# EAGLE design ESP32-SIM7000-with-lipo-v1 (EAGLE 8.7.1)

## Sheet 1 of 2
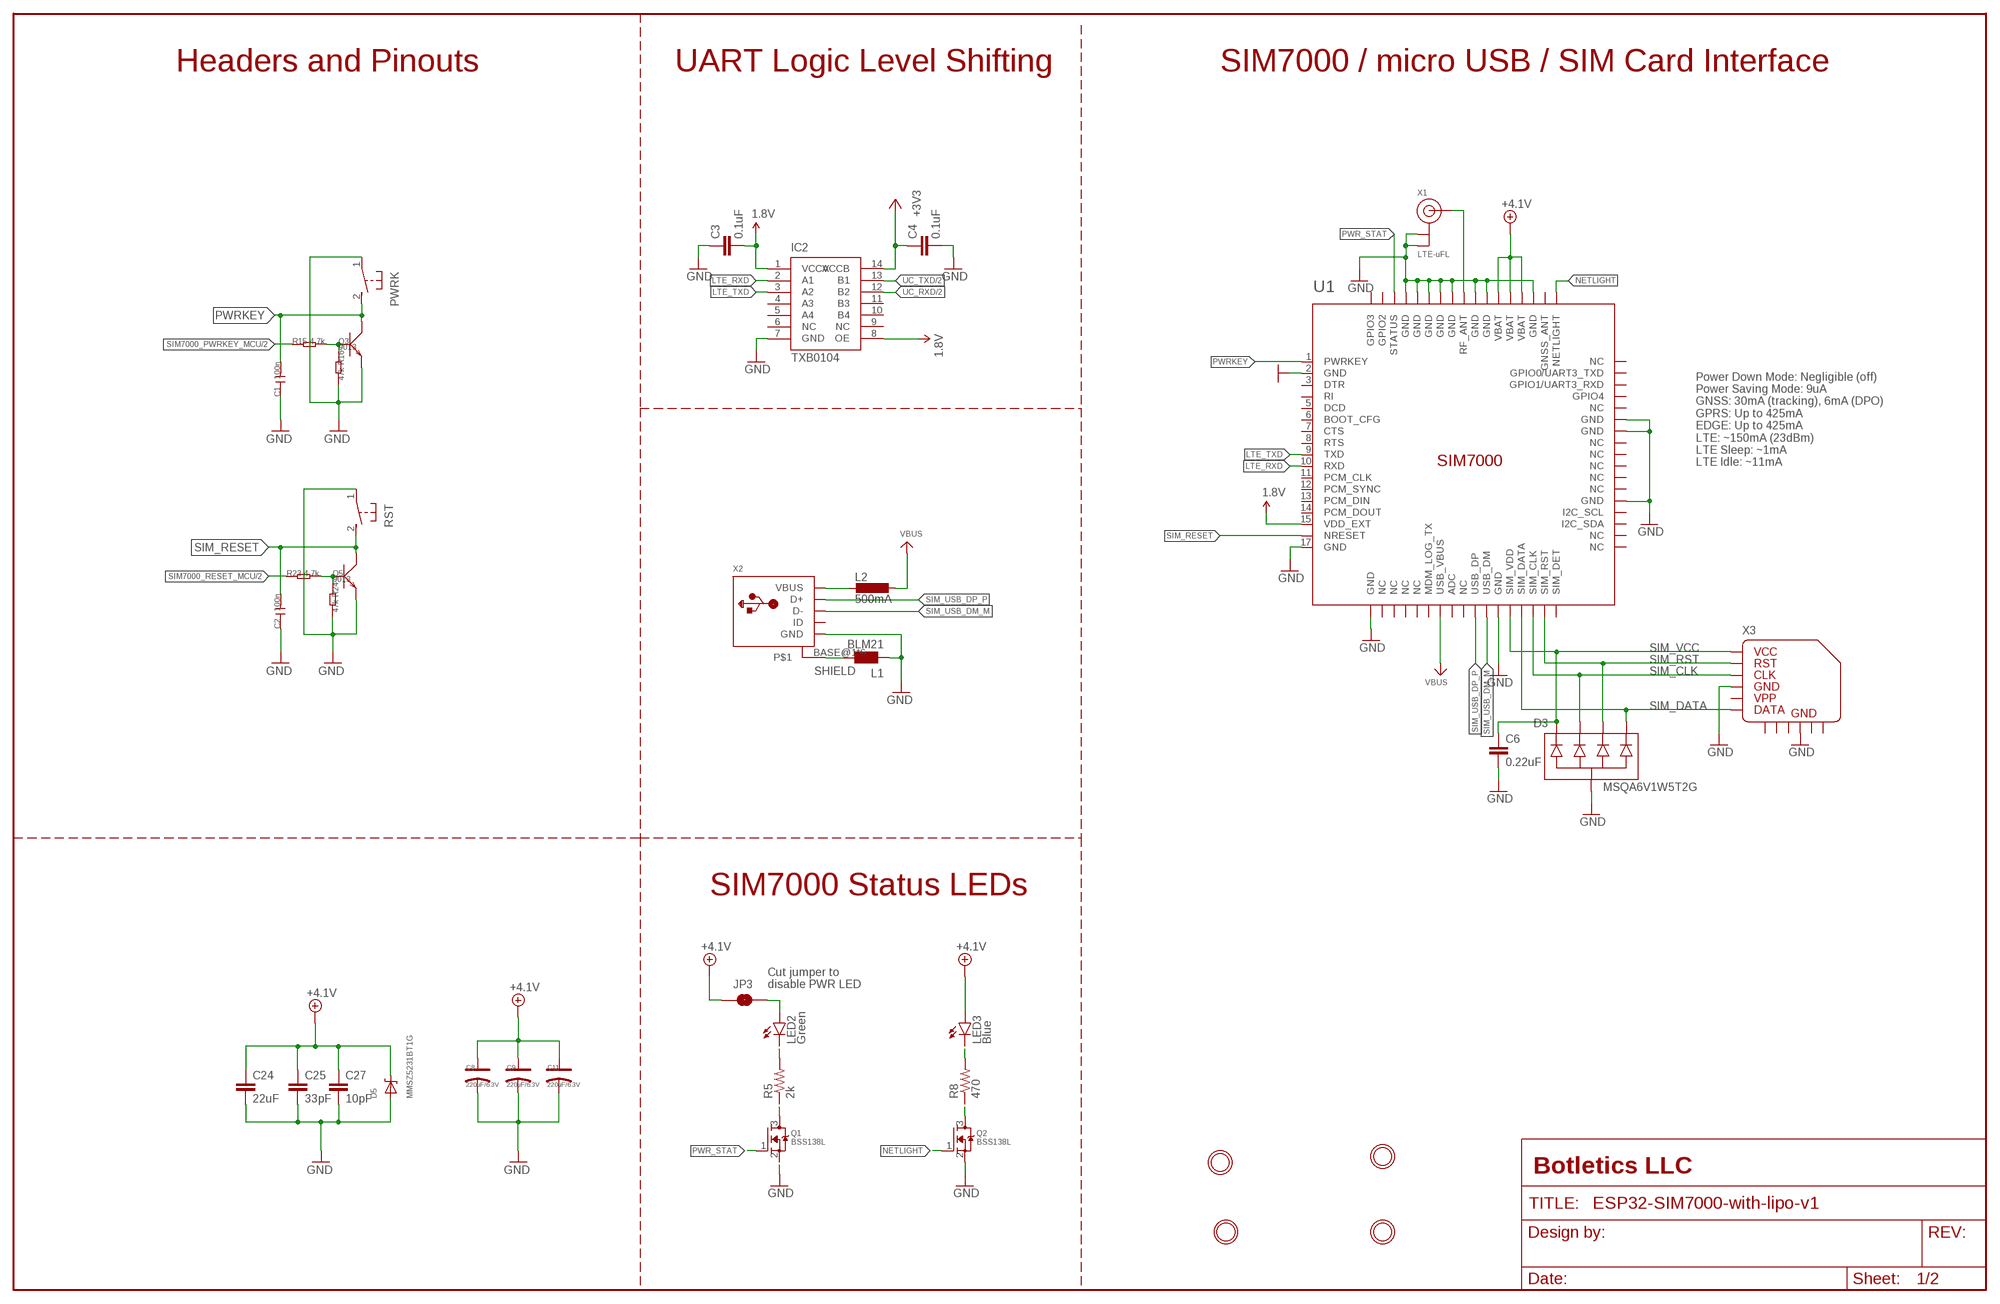
[diagram p0: schematic, sheet 1]

### Parts
$H1  MOUNTINGHOLE3.0THIN  [MOUNTINGHOLE_3.0_PLATEDTHIN]
$H2  MOUNTINGHOLE3.0THIN  [MOUNTINGHOLE_3.0_PLATEDTHIN]
$H3  MOUNTINGHOLE3.0THIN  [MOUNTINGHOLE_3.0_PLATEDTHIN]
$H4  MOUNTINGHOLE3.0THIN  [MOUNTINGHOLE_3.0_PLATEDTHIN]
C1  100n  C-0805  [0805]
C2  100n  C-0805  [0805]
C3  0.1uF  CAPMARKED-0603  [0603-CAP-MARKED]
C4  0.1uF  CAPMARKED-0603  [0603-CAP-MARKED]
C6  0.22uF  CAPMARKED-0603  [0603-CAP-MARKED]
C8  220uF/6.3V  006-CAP_AVX_C  [AVX_C]
C9  220uF/6.3V  006-CAP_AVX_C  [AVX_C]
C11  220uF/6.3V  006-CAP_AVX_C  [AVX_C]
C24  22uF  22UF-0805-6.3V-20%  [0805]
C25  33pF  22UF-0805-6.3V-20%  [0805]
C27  10pF  22UF-0805-6.3V-20%  [0805]
D3  MSQA6V1W5T2G  TVS-DIODE-ARRAY-4X  [SOT-353]
D5  MMSZ5231BT1G  DIODE-ZENERSOD123  [SOD-123]
IC2  TXB0104  LEVEL_SHIFTER_TXB0104TXB0104DR  [SOIC-14]
JP3  JUMPER-SMT_2_NC_TRACE_SILK  [SMT-JUMPER_2_NC_TRACE_SILK]
L1  BLM21  WE-CBF_0805  [0805]
L2  500mA  L-EUL1812  [L1812]
LED2  Green  LED0603-MARKED  [LED-0603-MARKED]
LED3  Blue  LED0603-MARKED  [LED-0603-MARKED]
PWRK  DTSM-3  [DTSM-3]
Q1  BSS138L  MOSFET-NGENERIC  [SOT23-3]
Q2  BSS138L  MOSFET-NGENERIC  [SOT23-3]
Q3  9013  TRANSISTOR-NPN-SOT23  [SOT23]
Q5  9013  TRANSISTOR-NPN-SOT23  [SOT23]
R5  2k  RESISTORMARKED-0603  [0603-RES-MARKED]
R8  470  RESISTORMARKED-0603  [0603-RES-MARKED]
R15  4.7k  R-0805  [0805]
R16  47k  R-0805  [0805]
R23  4.7k  R-0805  [0805]
R24  47k  R-0805  [0805]
RST  DTSM-3  [DTSM-3]
U1  SIM7000  [SIM7000]
X1  LTE-uFL  ANTENNA_U.FL  [U.FL]
X2  USB_MICRO_20329_V2  [4UCONN_20329_V2]
X3  MICROSIM_SOCKET_PUSH-PULL  [MICROSIM_SOCKET_PUSH-PULL]

### Nets
1.8V: C3.2 IC2.1(VCCA) IC2.8(OE) U1.15(VDD_EXT)
+3V3: C4.1 IC2.14(VCCB) ; also sheet 2
+4.1V: C8.+ C9.+ C11.+ C24.1 C25.1 C27.1 D5.C JP3.1 LED3.A U1.55(VBAT) U1.56(VBAT) U1.57(VBAT) ; also sheet 2
GND: C1.1 C2.1 C3.1 C4.2 C6.2 C8.- C9.- C11.- C24.2 C25.2 C27.2 D3.2(COM) D5.A IC2.7(GND) L1.1 PWRK.1 Q1.2(S) Q2.2(S) Q3.2(E) Q5.2(E) R16.2 R24.2 RST.1 U1.2(GND) U1.17(GND) U1.18(GND) U1.29(GND) U1.39(GND) U1.45(GND) U1.46(GND) U1.54(GND) U1.58(GND) U1.59(GND) U1.61(GND) U1.62(GND) U1.63(GND) U1.64(GND) U1.65(GND) X1.1(GND) X1.2(GND) X2.GND X3.C5 X3.GND@4(GND) ; also sheet 2
LTE_RXD: IC2.2(A1) U1.10(RXD)
LTE_TXD: IC2.3(A2) U1.9(TXD)
N$4: Q1.3(D) R5.1
N$5: LED2.C R5.2
N$10: Q2.3(D) R8.1
N$11: LED3.C R8.2
N$12: JP3.2 LED2.A
N$14: Q5.1(B) R23.2 R24.1
N$15: L2.2 X2.VBUS
N$36: Q3.1(B) R15.2 R16.1
NETLIGHT: Q2.1(G) U1.52(NETLIGHT)
PWR_STAT: Q1.1(G) U1.66(STATUS)
PWRKEY: C1.2 PWRK.2 Q3.3(C) U1.1(PWRKEY)
RF_ANT: U1.60(RF_ANT) X1.3(SIGNAL)
SHIELD: L1.2 X2.BASE@1 X2.BASE@2 X2.SPRT@1 X2.SPRT@2 X2.SPRT@3 X2.SPRT@4
SIM7000_PWRKEY_MCU: R15.1 ; also sheet 2
SIM7000_RESET_MCU: R23.1 ; also sheet 2
SIM_CLK: D3.3 U1.32(SIM_CLK) X3.C3
SIM_DATA: D3.5 U1.31(SIM_DATA) X3.C7
SIM_RESET: C2.2 Q5.3(C) RST.2 U1.16(NRESET)
SIM_RST: D3.4 U1.33(SIM_RST) X3.C2
SIM_USB_DM_M: U1.28(USB_DM) X2.D-
SIM_USB_DP_P: U1.27(USB_DP) X2.D+
SIM_VCC: C6.1 D3.1 U1.30(SIM_VDD) X3.C1
UC_RXD: IC2.12(B2) ; also sheet 2
UC_TXD: IC2.13(B1) ; also sheet 2
VBUS [usbvcc]: L2.1 U1.24(USB_VBUS) ; also sheet 2
Unconnected: IC2.4(A3) IC2.5(A4) IC2.6(NC) IC2.9(NC) IC2.10(B4) IC2.11(B3) U1.3(DTR) U1.4(RI) U1.5(DCD) U1.6(BOOT_CFG) U1.7(CTS) U1.8(RTS) U1.11(PCM_CLK) U1.12(PCM_SYNC) U1.13(PCM_DIN) U1.14(PCM_DOUT) U1.19(NC) U1.20(NC) U1.21(NC) U1.22(NC) U1.23(MDM_LOG_TX) U1.25(ADC) U1.26(NC) U1.34(SIM_DET) U1.35(NC) U1.36(NC) U1.37(I2C_SDA) U1.38(I2C_SCL) U1.40(NC) U1.41(NC) U1.42(NC) U1.43(NC) U1.44(NC) U1.47(NC) U1.48(GPIO4) U1.49(GPIO1/UART3_RXD) U1.50(GPIO0/UART3_TXD) U1.51(NC) U1.53(GNSS_ANT) U1.67(GPIO2) U1.68(GPIO3) X2.ID X3.C6

### Notes on the sheet
- Headers and Pinouts | UART Logic Level Shifting | SIM7000 / micro USB / SIM Card Interface
- Power Down Mode: Negligible (off)
  Power Saving Mode: 9uA
  GNSS: 30mA (tracking), 6mA (DPO)
  GPRS: Up to 425mA
  EDGE: Up to 425mA
  LTE: ~150mA (23dBm)
  LTE Sleep: ~1mA
  LTE Idle: ~11mA
- SIM7000 Status LEDs
- Cut jumper to
  disable PWR LED

## Sheet 2 of 2
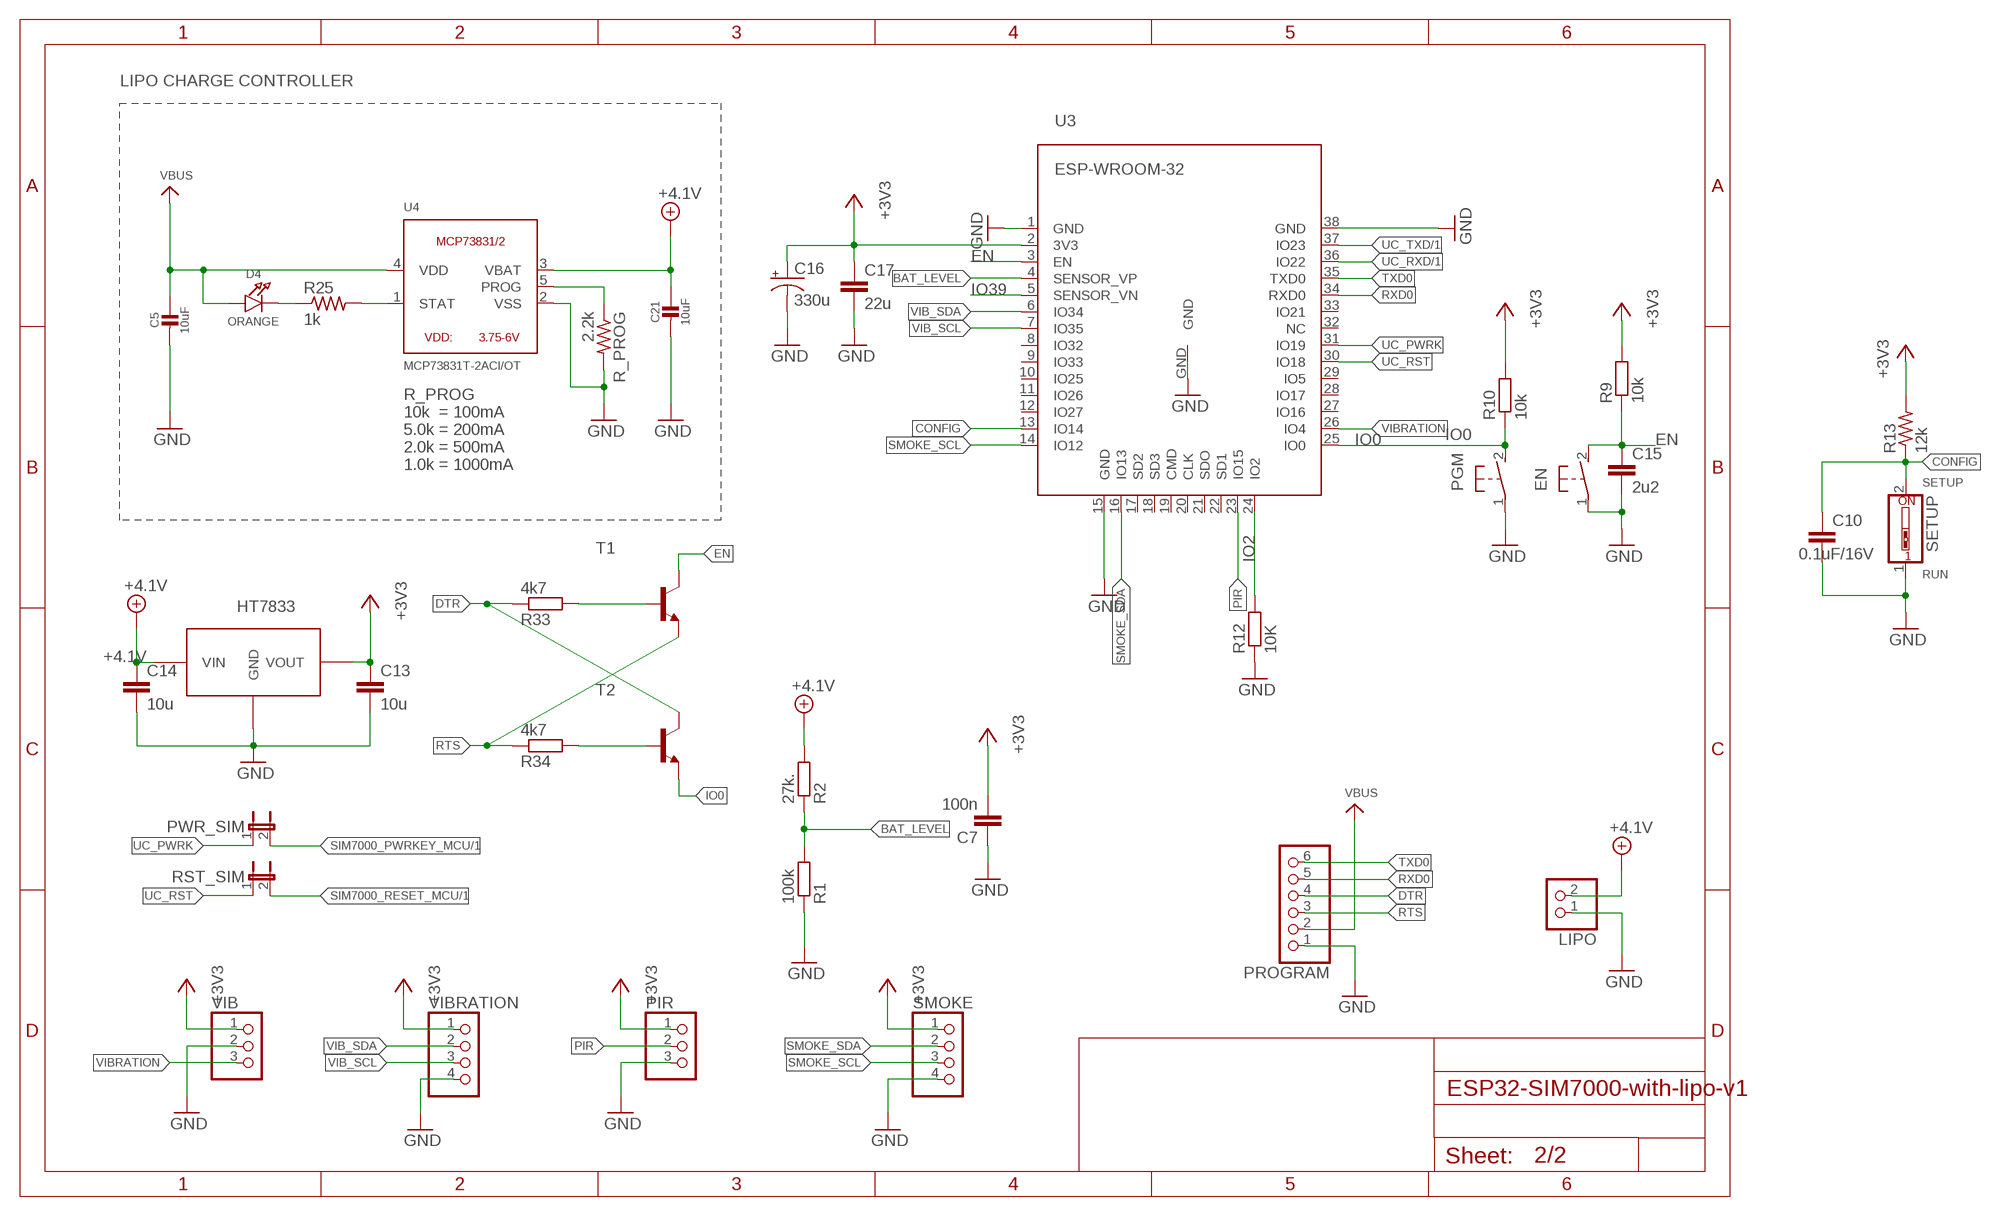
[diagram p1: schematic, sheet 2]

### Parts
C5  10uF  CAP_CERAMIC_0805  [_0805]
C7  100n  C-EUC0805  [C0805]
C10  0.1uF/16V  C-EUC0805K  [C0805K]
C13  10u  C-EUC0603  [C0603]
C14  10u  C-EUC0603  [C0603]
C15  2u2  C-EUC0603  [C0603]
C16  330u  CAP_POLSMD  [VISHAY_C]
C17  22u  CAP0805  [0805]
C21  10uF  CAP_CERAMIC_0805  [_0805]
D4  ORANGE  LED0805  [CHIPLED_0805]
EN  DTSM-3  [DTSM-3]
LIPO  PINHD-1X2  [1X02]
PGM  DTSM-3  [DTSM-3]
PIR  PINHD-1X3  [1X03]
PROGRAM  PINHD-1X6  [1X06]
PWR_SIM  SPARKFUN-PASSIVES_JUMPER-PTH-2-NC  [SPARKFUN-PASSIVES_PTH-JUMPER-NC_BOTTOM_NO_SILK]
R1  100k  R-EU_R0805  [R0805]
R2  27k.  R-EU_R0805  [R0805]
R9  10k  R-EU_R0603  [R0603@1]
R10  10k  R-EU_R0603  [R0603@1]
R12  10K  R-EU_R0603  [R0603@1]
R13  12k  R-US_M0805  [M0805]
R25  1k  R-US_M0805  [M0805]
R33  4k7  R-EU_R0805  [R0805]
R34  4k7  R-EU_R0805  [R0805]
R_PROG  2.2k  R-US_M0805  [M0805]
RST_SIM  SPARKFUN-PASSIVES_JUMPER-PTH-2-NC  [SPARKFUN-PASSIVES_PTH-JUMPER-NC_BOTTOM_NO_SILK]
SETUP  SW_DIP-1  [EDG-01]
SMOKE  PINHD-1X4  [1X04]
T1  MMBT3904LT1-NPN-SOT23-BEC  [SOT23-BEC]
T2  MMBT3904LT1-NPN-SOT23-BEC  [SOT23-BEC]
U3  ESP-WROOM-32  [ESP-WROOM-32]
U4  MCP73831T-2ACI/OT  MCP73831/2  [SOT23-5]
U$1  HT7833  HT7333  [SOT89]
VIB  PINHD-1X3  [1X03]
VIBRATION  PINHD-1X4  [1X04]

### Nets
+3V3: C7.2 C13.1 C16.+ C17.1 PIR.1 R9.2 R10.2 R13.2 SMOKE.1 U3.2(3V3) U$1.VOUT VIB.1 VIBRATION.1 ; also sheet 1
+4.1V: C14.1 C21.1 LIPO.2 R2.2 U4.3(VBAT) U$1.VIN ; also sheet 1
BAT_LEVEL: R1.2 R2.1 U3.4(SENSOR_VP)
CONFIG: C10.1 R13.1 SETUP.2 U3.13(IO14)
DTR: PROGRAM.4 R33.1 T2.C
EN: C15.1 EN.2 R9.1 T1.C U3.3(EN)
GND: C5.2 C7.1 C10.2 C13.2 C14.2 C15.2 C16.- C17.2 C21.2 EN.1 LIPO.1 PGM.1 PIR.3 PROGRAM.1 R1.1 R12.1 R_PROG.2 SETUP.1 SMOKE.4 U3.1(GND) U3.15(GND) U3.38(GND) U3.GND U4.2(VSS) U$1.GND VIB.2 VIBRATION.4 ; also sheet 1
IO0: PGM.2 R10.1 T2.E U3.25(IO0)
IO2: R12.2 U3.24(IO2)
IO39: U3.5(SENSOR_VN)
N$1: D4.C R25.1
N$2: R25.2 U4.1(STAT)
N$9: R_PROG.1 U4.5(PROG)
N$24: R33.2 T1.B
N$31: R34.2 T2.B
PIR: PIR.2 U3.23(IO15)
RTS: PROGRAM.3 R34.1 T1.E
RXD0: PROGRAM.5 U3.34(RXD0)
SIM7000_PWRKEY_MCU: PWR_SIM.2 ; also sheet 1
SIM7000_RESET_MCU: RST_SIM.2 ; also sheet 1
SMOKE_SCL: SMOKE.3 U3.14(IO12)
SMOKE_SDA: SMOKE.2 U3.16(IO13)
TXD0: PROGRAM.6 U3.35(TXD0)
UC_PWRK: PWR_SIM.1 U3.31(IO19)
UC_RST: RST_SIM.1 U3.30(IO18)
UC_RXD: U3.36(IO22) ; also sheet 1
UC_TXD: U3.37(IO23) ; also sheet 1
VBUS [usbvcc]: C5.1 D4.A PROGRAM.2 U4.4(VDD) ; also sheet 1
VIB_SCL: U3.7(IO35) VIBRATION.3
VIB_SDA: U3.6(IO34) VIBRATION.2
VIBRATION: U3.26(IO4) VIB.3
Unconnected: U3.8(IO32) U3.9(IO33) U3.10(IO25) U3.11(IO26) U3.12(IO27) U3.17(SD2) U3.18(SD3) U3.19(CMD) U3.20(CLK) U3.21(SDO) U3.22(SD1) U3.27(IO16) U3.28(IO17) U3.29(IO5) U3.32(NC) U3.33(IO21)

### Notes on the sheet
- LIPO CHARGE CONTROLLER
- R_PROG
  10k  = 100mA
  5.0k = 200mA
  2.0k = 500mA
  1.0k = 1000mA
- SETUP
- RUN

## Power pins joined to a net without a drawn wire
GND: X3.GND@1(GND) X3.GND@2(GND) X3.GND@3(GND) X3.GND@5(GND) X3.GND@6(GND)

## Library data of the parts
$H1-$H4 = Adafruit SIM808 Breakout:MOUNTINGHOLE: Mounting Hole For #2 screws (0.086"/2.18mm width, 0.094"/2.4mm hole) use 2.5mm; BOM: EXCLUDE
C1 C2 = discrete:C*: Ceramic Capacitors
C3 C4 C6 = TimWoo-Capacitors:CAP: Capacitor Standard 0603 ceramic capacitor, and 0.1" leaded capacitor.
C5 C21 = Adafruit111:CAP_CERAMIC: Ceramic Capacitors For new designs, use the packages preceded by an '_' character since they are more reliable: The following footprints should be used on most boards: _0402 - Standard footprint for regular board layouts _0603 - Standard footprint for regular board layouts _0805 - Standard footprint for regular board layouts _1206 - Standard footprint for regular board layouts For extremely tight-pitch boards where space is at a premium, the following 'micro-pitch' footprints can be used (smaller pads, no silkscreen outline, etc.): _0402MP - Micro-pitch footprint for very dense/compact boards _0603MP - Micro-pitch footprint for very dense/compact boards _0805MP - Micro-pitch footprint for very dense/compact boards _1206MP - Micro-pitch footprint for very dense/compact boards
C7 = SmartPrj:C-EU: CAPACITOR, European symbol
C8 C9 C11 = discrete:006-CAP*: Electrolytic Capacitors,Tantalum Capacitors and Super Capacitors
C10 C13-C15 = rcl:C-EU: CAPACITOR, European symbol
C16 = SparkFun-Passives:CAP_POL: Capacitor Polarized These are standard SMD and PTH capacitors. Normally 10uF, 47uF, and 100uF in electrolytic and tantalum varieties. Always verify the external diameter of the through hole cap, it varies with capacity, voltage, and manufacturer. The EIA devices should be standard.
C17 = SparkFun-Passives:CAP: Capacitor Standard 0603 ceramic capacitor, and 0.1" leaded capacitor.
C24 = SparkFun-Capacitors:22UF: 22µF ceramic capacitors A capacitor is a passive two-terminal electrical component used to store electrical energy temporarily in an electric field.; PROD_ID: CAP-08402
C25 C27 = SparkFun-Capacitors:22UF: 22µF ceramic capacitors A capacitor is a passive two-terminal electrical component used to store electrical energy temporarily in an electric field.; PROD_ID: CAP-08402; VALUE: 22uF
D3 = TimWoo-Diodes:TVS-DIODE-ARRAY-4X
D4 = LED-adafruit:LED: LED 0603 - 0603 Surface Mount Package 2mA: Green LED - Low Power (3.9mcd, 2ma, 1.7Vf) - Digikey: 475-2709-2-ND Orange LED - Low Power (9.8mcd, 2ma, 1.8Vf) - Digikey: 475-1194-2-ND Red LED - Low Power (5mcd, 2ma, 1.8Vf) - Digikey: 475-1195-2-ND Yellow LED - Low Power (7mcd, 2ma, 1.8Vf) - Digikey: 475-1196-2-ND 5mA: Blue LED - Low Power (17mcd, 5ma, 2.9Vf) - Digikey: LNJ937W8CRACT-ND 0805 - 0805 Surface Mount Package 2mA: Red LED (8.8mcd, 2mA, 1.8Vf, Clear) - Low Power [Digikey: 475-2510-1-ND] Green LED (5mcd, 2mA, 1.8Vf, Clear) - Low Power [Digikey: 475-2730-1-ND] Yellow LED (11.3mcd, 2mA, 1.8Vf, Clear) - Low Power [Digikey: 475-2555-1-ND] 20mA: Red LED (104mcd, 20mA, Diffused) - LS R976 [Digikey: 475-1278-6-ND] Red LED (12mcd, 20mA, 2.0Vf, Clear) - APT2012EC [Digikey: 754-1128-1-ND] Green LED (15mcd, 20mA, 2.2Vf, Clear) - APT2012GC [Digikey: 754-1131-1-ND] Orange LED (160mcd, 20mA, 2.1Vf, Clear) - APT2012SECK [Digikey: 754-1130-1-ND] 1206 - 1206 Surface Mount Package Green LED (26mcd, 20mA, Diffused) - LG N971 [Digikey: 475-1407-6-ND] Red LED (15mcd, 20mA, Diffused) - LH N974 [Digikey: 475-1416-6-ND] Cree - Cree High-Power Surface Mount LEDs XPEBWT-L1-0000-00D50 - White 111lm 350mA 2.9Vf 6200K 110° XTEAWT-00-0000-00000LEE3 - White 114lm 350mA 2.85Vf 5000K 115° Everlight - Everlight 45-21 Series Surface Mount LEDs 45-21/QK2C-B2832AC2CB2/2T - Warm White 2000mcd 20mA 3.25Vf 3050K 120° 45-21/LK2C-B38452C4CB2/2T - Nuetral White 2000mcd 20mA 3.25Vf 4150K 120° 45-21/LK2C-B50634C6CB2/2T - Cold White 2200mcd 20mA 3.25Vf 5650K 120° PLCC2 Reverse Mount LS T77K-J1L2-1-0-2-R18-Z - Red 11.25mcd 2mA 1.8Vf 630nm 120° LO T77K-L1M2-24-Z - Orange 19.6mcd 2mA 1.8Vf 606nm 120° LY T77K-K2M1-26-Z - Yellow 15.7mcd 2mA 1.8Vf 587nm 120°
D5 = Adafruit SIM808 Breakout:DIODE-ZENER: Zener Diode SMA: 30V 1W Zener Diode, 1.2Vf - Digikey: SMAZ30-FDICT-ND
EN PGM PWRK RST = switch-tact:DTSM-3
IC2 = TimWoo-IC:LEVEL_SHIFTER_TXB0104
JP3 = TimWoo-Connectors:JUMPER-SMT_2_NC_TRACE: Normally closed trace jumper This jumper has a trace between two pads so it's normally closed (NC). Use a razor knife to open the connection. For best results follow the IPC guidelines for cutting traces: Cutout at least 0.063 mm (0.005 in). Remove all loose material to clean up the cut area. Seal the cut with an approved epoxy. Reapply solder to reclose the connection.
L1 = wuerth-elektronik:WE-CBF: SMD EMI Suppression Ferrite Beads - excellent anti-EMI properties - low DCR - impedances till 3000 ohms - rated current up to 6 A
L2 = rcl:L-EU: INDUCTOR, European symbol; SPICEPREFIX: L
LED2 LED3 = TimWoo-LED:LED: LEDs Standard schematic elements and footprints for 5mm, 3mm, 1206, and 0603 sized LEDs. 5mm - Spark Fun Electronics SKU : COM-00529 (and others)
LIPO = pinhead:PINHD-1X2: PIN HEADER
PIR VIB = pinhead:PINHD-1X3: PIN HEADER
PROGRAM = pinhead:PINHD-1X6: PIN HEADER
PWR_SIM RST_SIM = ESP8266_Sparkfun:SPARKFUN-PASSIVES_JUMPER-PTH-2-NC
Q1 Q2 = TimWoo-MOSFETs:MOSFET-N: N-Channel Mosfet DMG2302UK - 20V 2.8A SOT23 [Digikey: DMG2302UK-7DICT-ND] 2N7002E - 60V 260mA SOT23 [Digikey: 2N7002ET1GOSTR-ND] - REEL BSH103 - 30V 850mA SOT23 [Digikey: 568-5013-1-ND]
Q3 Q5 = discrete:TRANSISTOR-NPN*: NPN audion
R1 R2 R33 R34 = SmartPrj:R-EU_: RESISTOR, European symbol
R5 R8 = TimWoo-Resistors:RESISTOR: Resistor Basic schematic elements and footprints for 0603, 1206, and PTH resistors.
R9 R10 R12 = rcl:R-EU_: RESISTOR, European symbol
R13 = rcl:R-US_: RESISTOR, American symbol
R15 R16 R23 R24 = discrete:R*
R25 R_PROG = resistor:R-US_: RESISTOR, American symbol
SETUP = special:SW_DIP-1: DIP SWITCH
SMOKE VIBRATION = pinhead:PINHD-1X4: PIN HEADER
T1 T2 = transistor:*-NPN-: NPN Transistror BF959 corrected 2008.03.06
U1 = TimWoo-RF:SIM7000
U3 = esp32:ESP-WROOM-32
U4 = MCP73831:MCP73831/2: MCP73831/2 LIPO Charger VDD: 3.75 - 6V Temp -40 - 85°C Programmable Charge Rate: 15-500mA NOTE: STAT is a tri-state logic output on the MCP73831 and an open-drain output on the MCP73832. SOT23-5 with 4.2V output and tri-state logic on STAT = MCP73831T-2ACI/OT
U$1 = HT7333_SOT89:HT7333
X1 = TimWoo-Connectors:ANTENNA_U.FL: U.FL Antenna Connector
X2 = Adafruit SIM808 Breakout:USB: USB Connectors USBMINIB - Surface Mount Female Mini-B USB Connector 4UConnector: 06564
X3 = TimWoo-Connectors:MICROSIM_SOCKET_PUSH-PULL: https://www.digikey.com/product-detail/en/molex-llc/0786463001/WM9364CT-ND/3770350

## Net classes
0 default: width 0.254 mm, clearance 0.203 mm
1 power: width 0.406 mm, clearance 0.203 mm
2 gnd: width 0.203 mm, drill 0.356 mm, clearance 0.203 mm
3 usbvcc: width 0.508 mm, drill 0.356 mm, clearance 0.203 mm

## Board
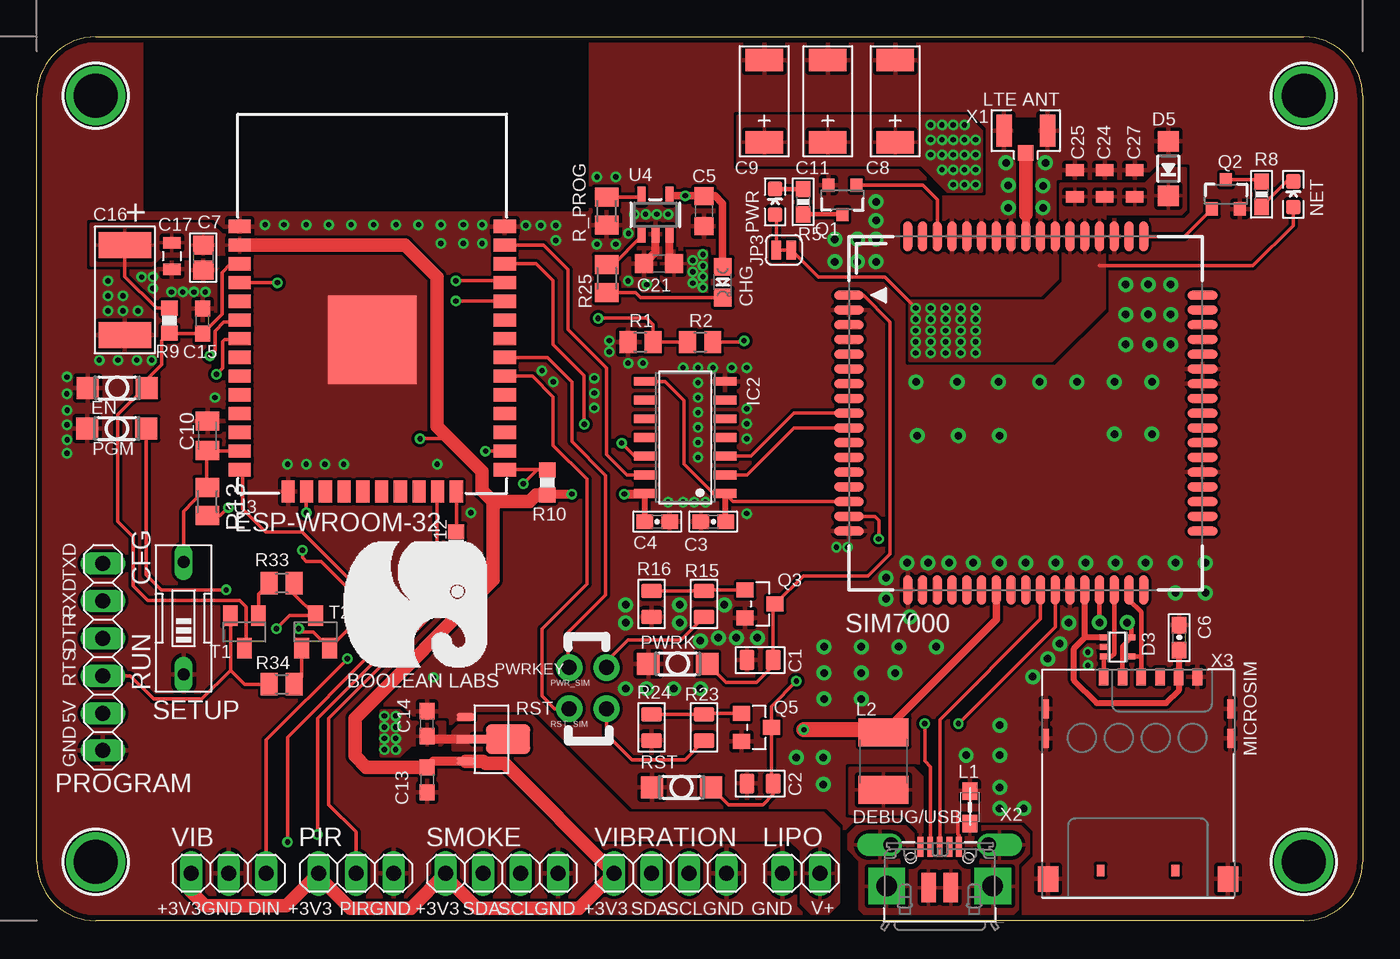
[diagram p2: board, top side]
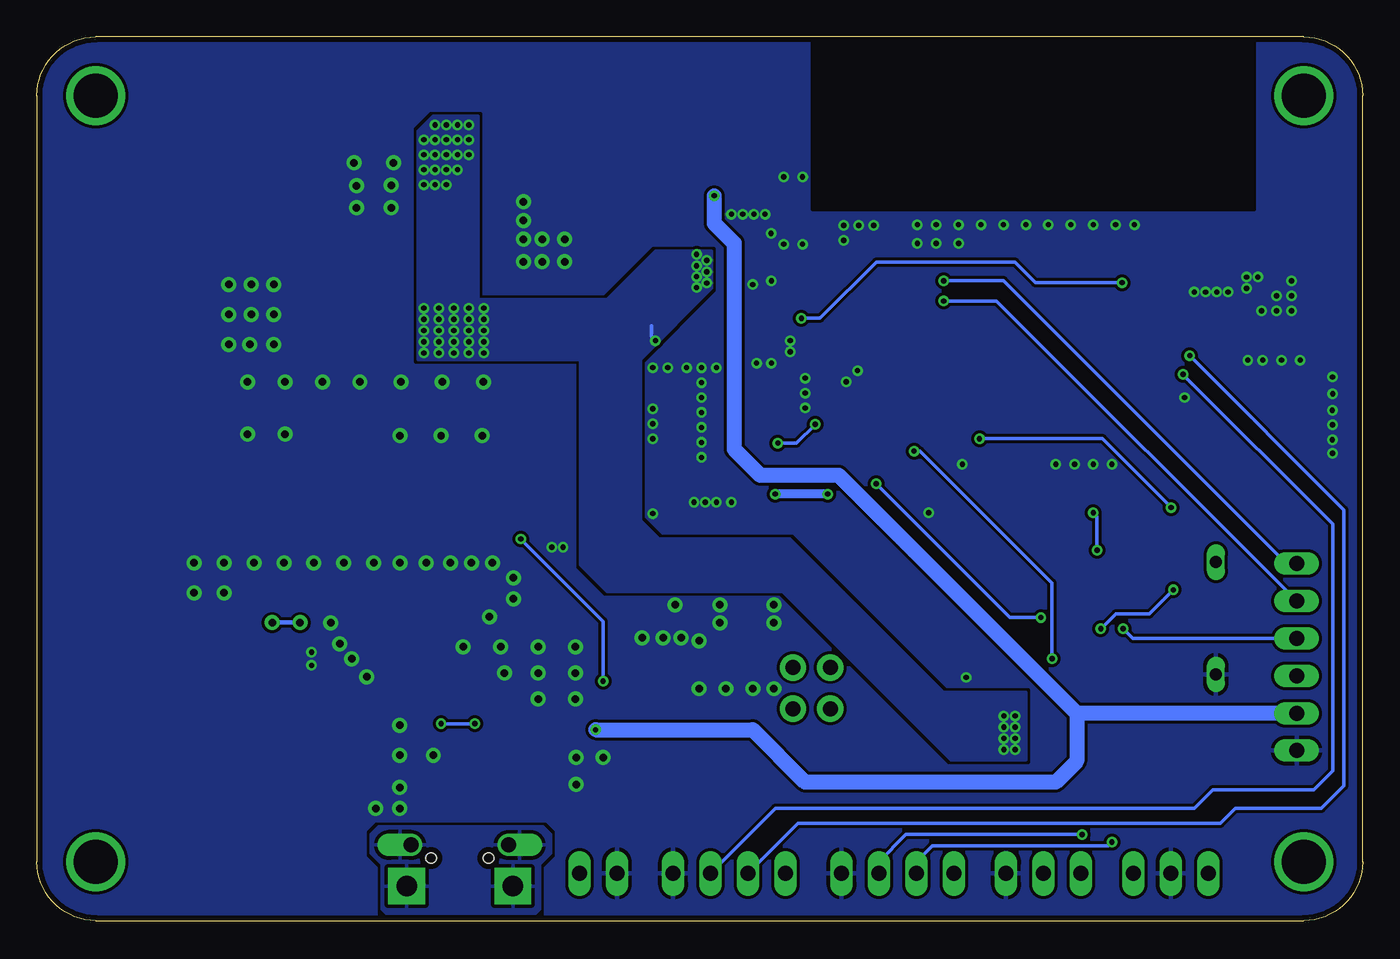
[diagram p3: board, bottom side, seen from below]

Size 90 x 60 mm. Coordinates in mm from the lower left corner, seen from the top.
Outline: 0,4 0,56 arc-90 4,60 86,60 arc-90 90,56 90,4 arc-90 86,0 4,0 arc-90 0,4
Copper layers (1*16): Top 0.0356mm / dielectric 1.5011mm / Bottom 0.0356mm
Design rules "oshpark-2layer *": minimum track width 8mil, minimum drill 14mil, track to track 8mil, track to pad 8mil, pad to pad 8mil, via to via 8mil, smd to smd 8mil, copper to edge 15mil, drill to drill 8mil, minimum pad ring 7mil, minimum via ring 7mil, stop-mask expansion 2.5mil, vias tented up to drill 14mil, thermal gap 10mil

### Footprints (pad centres in the part's own frame; a part is rotated, then mirrored left to right if it is on the bottom)
MOUNTINGHOLE_3.0_PLATEDTHIN = drill 3 pad 3.6: P$1 0,0
0805 = smd 1.016 x 1.397: 1 -0.889,0; 2 0.889,0
0603-CAP-MARKED = smd 1.1 x 1: 1 -0.85,0; 2 0.85,0
_0805 = smd 1.2 x 1.3: 1 -1.016,0; 2 1.016,0
C0805 = smd 1.3 x 1.4: 1 -0.85,0; 2 0.85,0
AVX_C = smd 1.524 x 2.54: + -2.794,0; - 2.794,0
C0805K = smd 1.3 x 1.6: 1 -1,0; 2 1,0
C0603 = smd 1.1 x 1: 1 -0.85,0; 2 0.85,0
VISHAY_C = smd 3.556 x 1.778: + 0,3.048; - 0,-3.048
0805' = smd 0.8 x 1.2: 1 -0.9,0; 2 0.9,0
SOT-353 = smd 0.4 x 0.5: 1 -0.65,-0.95; 2 0,-0.95; 3 0.65,-0.95; 4 0.65,0.95; 5 -0.65,0.95
CHIPLED_0805 = smd 1.2 x 1.2: A 0,-1.05; C 0,1.05
SOD-123 = smd 1.4 x 1.4: A 1.85,0; C -1.85,0
DTSM-3 = smd 1.5 x 1.5: 1 -2,0; 2 2,0
SOIC-14 = smd 0.6 x 1.55: 1 -3.81,-2.7; 2 -2.54,-2.7; 3 -1.27,-2.7; 4 0,-2.7; 5 1.27,-2.7; 6 2.54,-2.7; 7 3.81,-2.7; 8 3.81,2.7; 9 2.54,2.7; 10 1.27,2.7; 11 0,2.7; 12 -1.27,2.7; 13 -2.54,2.7; 14 -3.81,2.7
SMT-JUMPER_2_NC_TRACE_SILK = smd 0.635 x 1.27: 1 -0.508,0; 2 0.508,0
0805'' = smd 1.2 x 1: 1 -1.1,0; 2 1.1,0
L1812 = smd 1.9 x 3.4: 1 -1.95,0; 2 1.95,0
LED-0603-MARKED = smd 1 x 1: A -0.877,0; C 0.877,0
1X02 = drill 1.016 long: 1 -1.27,0; 2 1.27,0
1X03 = drill 1.016 long: 1 -2.54,0; 2 0,0; 3 2.54,0
1X06 = drill 1.016 long: 1 -6.35,0; 2 -3.81,0; 3 -1.27,0; 4 1.27,0; 5 3.81,0; 6 6.35,0
SPARKFUN-PASSIVES_PTH-JUMPER-NC_BOTTOM_NO_SILK = drill 1.016 pad 1.778: 1 -1.27,0; 2 1.27,0
SOT23-3 = smd 0.8 x 0.9: 1 -0.95,-1; 2 0.95,-1; 3 0,1
SOT23 = smd 1.016 x 1.143: 1 -0.95,-1.016; 2 0.95,-1.016; 3 0,1.016
R0805 = smd 1.15 x 1.5: 1 -0.85,0; 2 0.85,0
0603-RES-MARKED = smd 1.1 x 1: 1 -0.85,0; 2 0.85,0
R0603@1 = smd 1 x 1.1: 1 -0.85,0; 2 0.85,0
M0805 = smd 1.3 x 1.6: 1 -0.95,0; 2 0.95,0
EDG-01 = drill 0.813 long: 1 0,-3.81; 2 0,3.81
1X04 = drill 1.016 long: 1 -3.81,0; 2 -1.27,0; 3 1.27,0; 4 3.81,0
SOT23-BEC = smd 1 x 1.4: B -0.95,-1.1; C 0,1.1; E 0.95,-1.1
SIM7000 = smd 2 x 0.6: 1 -12,8; 2 -12,7; 3 -12,6; 4 -12,5; 5 -12,4; 6 -12,3; 7 -12,2; 8 -12,1; 9 -12,0; 10 -12,-1; 11 -12,-2; 12 -12,-3; 13 -12,-4; 14 -12,-5; 15 -12,-6; 16 -12,-7; 17 -12,-8; 35 12,-8; 36 12,-7; 37 12,-6; 38 12,-5; 39 12,-4; 40 12,-3; 41 12,-2; 42 12,-1; 43 12,0; 44 12,1; 45 12,2; 46 12,3; 47 12,4; 48 12,5; 49 12,6; 50 12,7; 51 12,8 | smd 0.6 x 2: 18 -8,-12; 19 -7,-12; 20 -6,-12; 21 -5,-12; 22 -4,-12; 23 -3,-12; 24 -2,-12; 25 -1,-12; 26 0,-12; 27 1,-12; 28 2,-12; 29 3,-12; 30 4,-12; 31 5,-12; 32 6,-12; 33 7,-12; 34 8,-12; 52 8,12; 53 7,12; 54 6,12; 55 5,12; 56 4,12; 57 3,12; 58 2,12; 59 1,12; 60 0,12; 61 -1,12; 62 -2,12; 63 -3,12; 64 -4,12; 65 -5,12; 66 -6,12; 67 -7,12; 68 -8,12
ESP-WROOM-32 = smd 0.9 x 1.5: 1 7.7,9; 2 6.43,9; 3 5.16,9; 4 3.89,9; 5 2.62,9; 6 1.35,9; 7 0.08,9; 8 -1.19,9; 9 -2.46,9; 10 -3.73,9; 11 -5,9; 12 -6.27,9; 13 -7.54,9; 14 -8.81,9; 25 -8.81,-9; 26 -7.54,-9; 27 -6.27,-9; 28 -5,-9; 29 -3.73,-9; 30 -2.46,-9; 31 -1.19,-9; 32 0.08,-9; 33 1.35,-9; 34 2.62,-9; 35 3.89,-9; 36 5.16,-9; 37 6.43,-9; 38 7.7,-9 | smd 1.5 x 0.9: 15 -10.3,5.715; 16 -10.3,4.445; 17 -10.3,3.175; 18 -10.3,1.905; 19 -10.3,0.635; 20 -10.3,-0.635; 21 -10.3,-1.905; 22 -10.3,-3.175; 23 -10.3,-4.445; 24 -10.3,-5.715 | smd 6 x 6: GND 0,0
SOT23-5 = smd 0.55 x 1.2: 1 -0.95,-1.3; 2 0,-1.3; 3 0.95,-1.3; 4 0.95,1.3; 5 -0.95,1.3
SOT89 = smd 0.559 x 1.194: GND -1.499,-0.597; VIN 0,-0.597; VOUT 1.499,-0.597 | smd 0.6 x 2: P$1 0,0.9 | smd 2 x 3: P$4 0,2.286
U.FL = smd 2.2 x 1.05: 1 0,1.475; 2 0,-1.475 | smd 1.05 x 1.05: 3 1.525,0
4UCONN_20329_V2 = smd 1 x 2: BASE@1 -0.75,-2; BASE@2 0.75,-2 | smd 0.4 x 1.35: D+ 0,0.775; D- -0.65,0.775; GND 1.3,0.775; ID 0.65,0.775; VBUS -1.3,0.775 | drill 1.016 pad 1.454 offset: SPRT@1 -3.3,0.9; SPRT@2 3.3,0.9 | drill 1.397 pad 2.5 square: SPRT@3 -3.6,-1.9; SPRT@4 3.6,-1.9 | hole 0.7: -1.95,0; 1.95,0
MICROSIM_SOCKET_PUSH-PULL = smd 1.15 x 0.65: C1 -6.865,2.755; C2 -6.865,0.215; C3 -6.865,-2.325; C5 -6.865,4.025; C6 -6.865,1.485; C7 -6.865,-1.055 | smd 1.3 x 0.45: GND@1 -4.695,6.27; GND@2 -2.695,6.27; GND@3 -4.695,-6.27; GND@4 -2.695,-6.27 | smd 1.7 x 1.4: GND@5 6.865,6.105; GND@6 6.865,-6.105 | smd 0.8 x 0.54: X1 6.285,2.54; X2 6.285,-2.54

### Placement (x,y rotation side)
$H1  4,4 0 top
$H2  86,4 0 top
$H3  4,56 0 top
$H4  86,56 0 top
C1  49.1,17.69 0 top
C2  49.1,9.3 0 top
C3  45.92,27.08 0 top
C4  42.11,27.08 0 top
C5  45.29,48.17 270 top
C6  77.54,19.21 90 top
C7  11.3,45.01 90 top
C8  58.27,55.63 90 top
C9  49.38,55.63 90 top
C10  11.58,32.92 90 top
C11  53.7,55.63 90 top
C13  26.49,9.56 270 top
C14  26.49,13.37 90 top
C15  11.26,40.71 90 top
C16  5.97,42.81 0 top
C17  22u  [0805']  9.17,45.12 270 top
C21  42.24,44.61 180 top
C24  22uF  [0805']  72.49,50.04 90 top
C25  33pF  [0805']  70.46,50.04 90 top
C27  10pF  [0805']  74.52,50.04 90 top
D3  73.35,18.57 270 top
D4  46.56,43.34 180 top
D5  76.81,51.05 90 top
EN  5.46,36.17 0 top
IC2  44.02,32.8 90 top
JP3  50.71,45.52 180 top
L1  BLM21  [0805'']  63.34,7.69 270 top
L2  57.48,10.83 270 top
LED2  50.11,48.8 90 top
LED3  85.29,49.31 90 top
LIPO  51.89,3.21 0 top
PGM  5.43,33.4 0 top
PIR  21.66,3.21 0 top
PROGRAM  4.49,17.89 90 top
PWR_SIM  37.41,17.18 0 top
PWRK  43.51,17.43 0 top
Q1  54.68,48.93 180 top
Q2  80.72,49.31 0 top
Q3  49.1,21.5 270 top
Q5  48.84,13.11 270 top
R1  40.97,39.28 0 top
R2  45.03,39.28 0 top
R5  52.02,48.8 90 top
R8  83.13,49.31 270 top
R9  9,40.73 90 top
R10  34.65,29.75 270 top
R12  28.46,25.55 90 top
R13  11.58,28.45 270 top
R15  45.29,21.5 90 top
R16  41.73,21.5 270 top
R23  45.29,13.11 90 top
R24  41.73,13.11 270 top
R25  38.68,43.59 90 top
R33  16.63,22.91 180 top
R34  16.63,16.05 0 top
R_PROG  38.68,48.17 270 top
RST  43.76,9.05 0 top
RST_SIM  37.41,14.38 0 top
SETUP  9.96,20.52 0 top
SMOKE  31.57,3.21 0 top
T1  14.09,19.61 180 top
T2  18.92,19.61 0 top
U1  67.13,34.45 0 top
U3  22.77,39.43 90 top
U4  41.98,47.91 0 top
U$1  29.7,12.32 270 top
VIB  13.03,3.21 0 top
VIBRATION  43,3.21 0 top
X1  67.13,53.63 270 top
X2  61.29,4.24 0 top
X3  74.75,9.69 270 top

### Tracks (layer width: path | path; a pad name or v marks a point on that pad's centre or on a via)
1.8V
  Top 0.254: U1.15 47.25,28.45 IC2.1 45.94,28.99 43.94,30.99 43.94,35.31 42.64,36.61 IC2.8
  Top 0.406: IC2.1 46.72,27.14 C3.2
+3V3  (via drill 0.36)
  Top 0.254: R9.2 8.12,41.58 5.96,43.74 5.97,43.74 C16.+ | R13.2 12.46,27.5 v13,28.04 | v26.01,32.72 27.64,32.72 27.81,32.89
  Top 0.406: IC2.14 41.26,28.93 C4.1 | 34.74,28.99 R10.2
  Top 0.61: U$1.VOUT 26.9,10.82 C13.1 | R10.2 34.71,28.96 v36.32,28.96 | v39.88,28.96 41.28,28.96 IC2.14
  Top 0.914: U3.2 25.01,45.86 27.18,43.69 27.18,33.53 27.81,32.89 30.23,30.48 30.23,29.21 30.99,28.45 | R10.2 33.89,28.9 33.44,28.45 30.99,28.45 | C13.1 22.36,10.41 21.59,11.18 21.59,13.72 30.99,23.11 30.99,28.45 | VIB.1 10.49,1.96 11.43,1.02 16.93,1.02 PIR.1 19.12,2.97 21.26,0.84 25.39,0.84 SMOKE.1 27.76,2.97 29.9,0.84 36.82,0.84 VIBRATION.1 31.74,10.66 30.45,10.66 30.29,10.82 U$1.VOUT
  Bottom 0.254: v13,28.04 17.68,32.72 v26.01,32.72
  Bottom 0.61: v36.32,28.96 v39.88,28.96
  pour Top: 3.68,47.29 11.81,47.29 12.57,46.53 14.6,46.53 14.85,46.28 14.85,45.51 14.6,45.26 10.79,45.26 10.64,45.11 8.4,45.11 7.79,44.5 3.68,44.5
+4.1V  (via drill 0.36)
  Top 0.254: R2.2 47.91,39.28 v48.01,39.37 | 72.14,44.45 82.55,44.45 85.29,47.19 LED3.A | JP3.1 53.04,43.69 57.56,43.69 v59.66,41.58
  Top 0.559: C21.1 42.93,44.93 U4.3
  Top 0.61: C14.1 26.69,12.32 29.1,12.32
  Bottom 0.254: v48.01,39.37 48.26,39.62 48.26,40.39
  other vias: 45.21,45.24 45.21,44.45 45.21,43.71 45.21,42.98 44.53,44.83 44.53,44.04 44.53,43.28 60.68,38.53 60.68,39.29 60.68,40.06 60.68,40.82 60.68,41.58 59.66,40.82 59.66,40.06 59.66,39.29 59.66,38.53 23.6,13.89 23.6,13.13 23.6,12.37 23.6,11.61 24.36,11.61 24.36,12.37 24.36,13.13 24.36,13.89 63.73,51.99 62.97,51.99 62.97,50.98 62.2,50.98 60.68,54.03 60.68,53.01 60.68,51.99 61.44,51.99 61.44,50.98 62.2,51.99 62.2,49.96 62.97,49.96 63.73,49.96 63.73,50.98 61.44,54.03 62.2,54.03 61.44,53.01 62.2,53.01 62.97,53.01 63.73,53.01 62.97,54.03 61.7,41.58 61.7,40.82 61.7,40.06 61.7,39.29 61.7,38.53 62.71,41.58 63.73,41.58 62.71,40.82 63.73,40.82 62.71,40.06 63.73,40.06 62.71,39.29 62.71,38.53 63.73,39.29 63.73,38.53
  pour Top: 28.27,12.86 29.28,13.88 33.6,13.88 40.21,7.27 53.41,7.27 54.43,6.26 54.43,1.18 53.67,0.41 52.65,0.41 51.89,1.18 51.89,4.73 51.13,5.49 37.92,5.49 31.82,11.59 28.27,11.59
  pour Bottom: 61.21,42.16 61.21,38.1 49.02,38.1 44.2,42.93 44.2,45.47 48.01,45.47 51.31,42.16
  pour Top: 45.47,45.47 45.47,42.67 43.18,42.67 42.42,43.43 42.42,45.47
  pour Top: 69.67,47.91 72.46,47.91 72.46,41.56 68.91,38.01 59.26,38.01 59.26,42.07 68.4,42.07 69.67,43.34
  pour Top: 27.69,13.46 25.4,13.46 24.64,14.22 23.37,14.22 23.37,11.18 24.64,11.18 25.4,11.94 27.43,11.94 27.69,12.19
  pour Bottom: 27.94,10.92 22.86,10.92 22.86,15.49 28.45,15.49 38.86,25.91 47.75,25.91 49.02,27.18 49.02,39.12 53.09,39.12 53.09,24.13 51.31,22.35 39.37,22.35
  pour Top: 69.52,47.47 69.52,50.01 75.29,50.04 76.3,51.05 77.95,51.05 77.95,48.26 77.7,48.01 72.49,48.01 72.49,47.5
  pour Top: 47.6,54.61 63.09,54.61 64.11,53.59 64.11,49.53 61.82,49.53 60.05,51.31 47.6,51.31
  pour Bottom: 60.05,54.61 63.09,54.61 64.11,53.59 64.11,38.1 60.05,38.1
BAT_LEVEL  (via drill 0.36)
  Top 0.254: R2.1 R1.2 41.82,40.48 41.4,40.89 v38.1,40.89 | U3.4 16.04,43.32 16.05,43.31 v16.33,43.31
  Bottom 0.254: v38.1,40.89 36.83,40.89 33.02,44.7 23.62,44.7 22.22,43.31 v16.33,43.31
CONFIG
  Top 0.254: R13.1 11.51,29.33 | 11.51,29.33 10.66,28.48 10.65,28.48 9.96,27.79 SETUP.2 | 11.51,29.33 11.51,31.85 C10.1 11.61,31.89 U3.13
DTR  (via drill 0.36)
  Top 0.254: R33.1 17.48,22.15 T2.C 17.15,20.71 v16.26,19.81
  Bottom 0.254: PROGRAM.4 15.61,19.16 v16.26,19.81
EN
  Top 0.254: U3.3 13.16,44.59 12.57,43.99 12.57,41.16 C15.1 9.27,39.86 9.25,39.88 R9.1 8.48,39.37 8.48,37.77 7.46,36.74 EN.2 7.31,36.17 5.49,34.34 5.49,27.11 6.55,26.05 6.55,22.71 7.52,21.74 8.93,21.74 8.94,21.74 13.78,21.74 14.21,21.3 14.21,18.63 T1.C
GND  (via drill 0.35, 0.36, 0.51 pad 1.02)
  Top 0.254: X2.GND 62.59,5.78 62.51,5.86 62.51,7.34 62.48,7.37
  Top 0.559: C21.2 41.98,45.37 U4.2
  other vias: 73.91,43.18 77.29,24.29 62.56,32.93 76.96,43.18 56.97,44.74 59.76,32.93 73.91,41.15 67.13,24.29 75.44,41.15 76.96,41.15 75.44,43.18 65.35,32.93 71.35,18.22 71.35,17.33 11.43,42.67 65.78,51.44 68.48,51.44 68.3,49.89 68.3,48.39 65.94,48.39 65.94,49.92 12.09,35.51 17.02,30.99 27.18,30.99 26.92,16.51 29.46,27.69 10.67,42.67 9.91,42.67 9.14,42.67 7.11,43.69 7.87,43.69 7.87,42.93 6.86,41.4 5.84,41.4 4.83,41.4 4.83,42.42 4.83,43.43 5.84,42.42 15.49,47.24 16.76,47.24 18.29,47.24 19.81,47.24 21.34,47.24 22.86,47.24 24.38,47.24 25.91,47.24 27.43,47.24 28.96,47.24 30.23,47.24 30.23,45.97 28.96,45.97 27.43,45.97 18.29,30.99 19.56,30.99 20.83,30.99 34.29,37.34 35.05,36.58 37.85,36.83 37.85,35.81 37.85,34.8 40.13,37.85 41.15,37.85 38.86,39.37 38.86,38.61 41.4,43.18 40.13,43.43 42.85,47.96 42.09,47.96 41.33,47.96 40.56,47.96 40.16,46.66 39.29,45.92 38.02,45.92 38.02,50.5 39.29,50.5 33.2,47.19 34.21,47.19 35.23,47.19 35.23,46.18 48.18,37.54 47.17,37.54 45.9,37.54 44.88,37.54 43.87,37.54 44.88,36.53 44.88,35.51 44.88,34.49 44.88,33.48 44.88,32.46 44.88,31.45 48.18,32.72 48.18,33.73 48.18,34.75 45.39,28.4 44.63,28.4 43.87,28.4 42.85,28.4 48.18,27.64 54.28,25.35 55.04,25.35 2.03,35.76 2.06,34.65 2.06,32.64 2.04,36.91 2.04,31.72 2.04,33.66 4.24,38.05 5.51,38.05 6.78,38.05 7.8,38.05 67,7.62 65.37,7.62 65.37,9.04 51.55,11.07 53.38,11.07 53.38,9.24 70.04,20.22 69.43,18.79 68.62,17.78 67.61,16.56 59.07,24.28 60.49,24.28 61.92,24.28 59.27,20.62 57.65,23.26 57.65,21.84 48.91,19.2 47.49,19.2 46.27,19.2 45.05,19 46.68,21.44 43.63,21.44 43.63,20.22 39.97,20.22 39.97,21.44 41.39,15.75 43.22,15.75 45.05,15.75 39.97,15.75 73.91,39.12 75.54,39.12 76.96,39.12 59.69,36.58 62.48,36.58 65.28,36.58 68.07,36.58 73.15,36.58 70.61,36.58 77.29,22.26 79.32,22.26 53.43,18.59 55.97,18.59 58.51,18.59 61.05,18.59 63.08,11.23 65.37,11.23 65.37,13.26 55.7,44.74 54.18,44.74 54.18,46.26 55.7,46.26 56.97,46.26 56.97,47.53 56.97,48.8 79.32,24.29 75.26,24.29 73.23,24.29 71.19,24.29 69.16,24.29 65.35,24.29 63.57,24.29 53.43,16.81 53.43,15.04 55.97,16.81 55.97,15.04 58.26,16.81 73.15,33.02 75.69,33.02 75.69,36.58
  pour Top (rank 6): -1,-1 -1,61 91,61 91,-1
  pour Bottom (rank 6): -1,-1 -1,61 91,61 91,-1
IO0  (via drill 0.36)
  Top 0.254: U3.25 34.63,30.62 R10.1 33.96,30.6 v33.02,29.65 | v17.78,19.81 17.98,19.61 18.77,19.61 T2.E 21.84,20.48 v21.84,20.57 | v12.85,22.45 8.43,22.45 7.43,23.46 PGM.2
  Bottom 0.254: v12.85,22.45 14.48,20.83 16.76,20.83 v17.78,19.81 | v33.02,29.65 23.94,20.57 v21.84,20.57
IO2
  Top 0.254: U3.24 28.48,26.42 R12.2
LTE_RXD
  Top 0.254: IC2.2 48.21,30.26 51.4,33.45 U1.10
LTE_TXD
  Top 0.254: IC2.3 48.46,31.53 51.38,34.45 U1.9
N$1
  Top 0.254: R25.1 40.64,42.64 40.99,42.29 D4.C
N$2
  Top 0.254: U4.1 41,46.57 41,46.4 39.14,44.54 R25.2
N$3
  cutout Top: 7.37,59.69 37.34,59.69 37.34,48.26 7.37,48.26
N$4
  Top 0.305: R5.1 54.66,47.95 Q1.3
N$5
  Top 0.254: LED2.C 50.62,49.68 50.65,49.65
  Top 0.305: 50.65,49.65 R5.2
N$6
  cutout Bottom: 7.37,59.69 37.34,59.69 37.34,48.26 7.37,48.26
N$9
  Top 0.254: R_PROG.1 40.94,49.12 U4.5
N$10
  Top 0.254: Q2.3 82.98,50.31 R8.1
  Top 0.305: 83.09,50.2 R8.1 | 80.73,50.33 Q2.3
N$11
  Top 0.254: R8.2 84.86,50.19 LED3.C
  Top 0.305: R8.2 83.13,48.53
N$12
  Top 0.254: JP3.2 50.2,47.84 LED2.A
N$14
  Top 0.254: Q5.1 45.35,14.06 R23.2 R24.1
N$15
  pour Top: 55.19,10.32 59.51,10.32 60.07,9.76 60.07,5.39 59.89,5.39 59.89,6.13 58.77,7.25 55.47,7.25 55.19,7.27
N$24
  Top 0.254: T1.B 15.04,22.17 R33.2
N$31
  Top 0.254: T2.B 17.97,16.54 R34.2
N$36
  Top 0.254: Q3.1 45.35,22.45 R15.2 R16.1
NETLIGHT
  Top 0.254: U1.52 77.91,46.45 Q2.1
PIR
  Top 0.254: PIR.2 21.66,6.02 19.81,7.87 19.81,13.72 27.18,21.08 27.18,29.09 U3.23
PWR_STAT
  Top 0.254: Q1.1 60.16,49.93 61.13,48.95 U1.66
  Top 0.305: 55.65,49.94 Q1.1
PWRKEY
  Top 0.254: PWRK.2 46.78,16.16 48.84,16.16 49.98,17.3 C1.2 49.98,21.37 Q3.3 52.03,23.41 56.43,23.41 57.91,24.89 57.91,40.64 56.1,42.45 U1.1
RF_ANT
  Top 0.559: 67.13,47.91 U1.60
  Top 0.914: X1.3 67.13,47.91
RTS
  Top 0.254: T1.E 13.14,17 | 13.14,17 14.09,16.05 R34.1 | PROGRAM.3 6.34,16.62 7.92,15.04 11.18,15.04 13.14,17
RXD0  (via drill 0.36)
  Top 0.254: v28.45,42.06 28.46,42.05 U3.34
  Bottom 0.254: v28.45,42.06 24.85,42.06 PROGRAM.5
SHIELD
  pour Top (rank 2): 56.13,0.51 55.88,0.76 55.88,4.06 55.12,4.83 55.12,5.84 55.63,6.35 66.8,6.35 67.31,5.84 67.31,4.57 66.55,3.81 66.55,0.76 66.29,0.51
  pour Bottom (rank 2): 56.13,0.51 55.88,0.76 55.88,3.81 55.12,4.57 55.12,5.84 55.63,6.35 66.8,6.35 67.31,5.84 67.31,4.57 66.55,3.81 66.55,0.76 66.29,0.51
SIM7000_PWRKEY_MCU
  Top 0.254: R15.1 43.73,19.05 40.13,19.05 38.68,17.6 PWR_SIM.2
SIM7000_RESET_MCU
  Top 0.254: R23.1 43.98,10.92 40.39,10.92 38.68,12.63 RST_SIM.2
SIM_CLK
  Top 0.305: U1.32 73.13,18.1 72.96,17.93 D3.3 72.42,17.9 X3.C3
SIM_DATA  (via drill 0.51 pad 1.02)
  Top 0.305: X3.C7 73.69,18.62 D3.5 74.3,19.91 74.01,20.2 v74.01,20.23 | v72.13,20.23 U1.31
  Bottom 0.305: v74.01,20.23 v72.13,20.23
SIM_RESET  (via drill 0.36)
  Top 0.254: RST.2 46.94,7.87 49.28,7.87 49.98,8.58 C2.2 49.86,9.43 Q5.3 49.86,14.55 v51.56,16.26 | U1.16 55.15,27.43 56.9,27.43 57.15,27.18 v57.15,25.91
  Bottom 0.254: v57.15,25.91 51.56,20.32 v51.56,16.26
SIM_RST
  Top 0.305: X3.C2 74.96,17.94 | D3.4 74.95,17.93 74.96,17.94 | U1.33 74.13,21.78 74.96,20.95 74.96,17.94
SIM_USB_DM_M  (via drill 0.36)
  Top 0.254: U1.28 69.13,19.94 v62.56,13.37 | v60.27,13.37 60.27,10.83 60.65,10.45 60.65,5.03 X2.D-
  Bottom 0.254: v62.56,13.37 v60.27,13.37
SIM_USB_DP_P
  Top 0.254: U1.27 68.13,20.46 61.29,13.62 X2.D+
SIM_VCC
  Top 0.406: C6.1 77.5,18.32 X3.C1 77.5,15.62 76.65,14.77 71.96,14.77 70.41,16.31 70.41,18.49 71.13,19.21 | 71.13,19.21 U1.30 | D3.1 71.14,19.23 71.13,19.21
SMOKE_SCL  (via drill 0.36)
  Top 0.254: v19.05,5.84 19.05,13.72 23.37,18.03 23.37,21.02 18,26.38 15.53,26.38 13.97,27.94 13.97,30.41 U3.14
  Bottom 0.254: v19.05,5.84 30.99,5.84 32.84,3.99 SMOKE.3
SMOKE_SDA  (via drill 0.36)
  Top 0.254: v17.02,5.33 17.02,12.45 22.61,18.03 22.61,21.08 19.3,24.38 18.29,24.38 18.03,24.64 v18.03,25.15 | v18.29,27.69 18.29,29.09 U3.16
  Bottom 0.254: SMOKE.2 30.3,3.99 29.21,5.08 17.27,5.08 v17.02,5.33 | v18.03,25.15 18.03,27.43 v18.29,27.69
TXD0  (via drill 0.36)
  Top 0.254: v28.45,43.43 31.65,43.43 U3.35
  Bottom 0.254: PROGRAM.6 5.19,24.24 24.38,43.43 v28.45,43.43
UC_PWRK
  Top 0.254: U3.31 34.66,38.24 36.32,36.58 36.32,32.51 38.61,30.23 38.61,22.1 36.07,19.56 36.07,17.25 PWR_SIM.1
UC_RST
  Top 0.254: RST_SIM.1 35.15,14.38 34.29,15.24 34.29,19.81 37.34,22.86 37.34,29.97 35.05,32.26 35.05,35.56 33.65,36.97 U3.30
UC_RXD  (via drill 0.36)
  Top 0.254: v37.16,33.69 37.16,36.99 35.05,39.1 35.05,43.43 33.9,44.59 U3.36 | v39.7,32.42 40.59,31.53 IC2.12
  Bottom 0.254: v37.16,33.69 38.43,32.42 v39.7,32.42
UC_TXD
  Top 0.254: IC2.13 40.08,30.26 38.68,31.66 38.68,37.5 36.07,40.11 36.07,44.2 34.41,45.86 U3.37
VBUS  (via drill 0.36)
  Top 0.508: U4.4 v44.02,49.21 45.26,49.21 | 45.26,49.21 C5.1 | D4.A 46.56,48.67 46.02,49.21 45.26,49.21 | U1.24 65.13,20.43 L2.1
  Top 1.016: L2.1 57.3,12.95 v52.07,12.95
  Bottom 1.016: PROGRAM.2 19.42,14.08 | 19.42,14.08 35.56,30.23 40.89,30.23 42.67,32 42.67,46 44.02,47.35 v44.02,49.21 | v52.07,12.95 41.4,12.95 37.85,9.4 20.83,9.4 19.42,10.81 19.42,14.08
VIB_SCL  (via drill 0.36)
  Top 0.254: U3.7 13.71,39.45 12.75,39.45 12.62,39.32 12.62,38.64 12.63,38.64 12.63,37.52 v12.19,37.08 12.14,37.03
  Bottom 0.254: VIBRATION.3 39.86,7.62 11.43,7.62 10.16,8.89 3.3,8.89 2.03,10.16 2.03,26.92 v12.19,37.08
VIB_SDA  (via drill 0.36)
  Top 0.254: U3.6 13.63,40.64 12.7,40.64 12.09,40.03 12.09,38.7 v11.74,38.35
  Bottom 0.254: VIBRATION.2 38.33,6.6 9.65,6.6 8.64,7.62 2.79,7.62 1.27,9.14 1.27,27.88 v11.74,38.35
VIBRATION  (via drill 0.36)
  Top 0.254: VIB.3 15.57,12.27 v21.08,17.78 | v30.45,31.88 31.76,31.88 U3.26
  Bottom 0.254: v21.08,17.78 21.08,22.91 30.05,31.88 v30.45,31.88

### Text on the board
tPlace: LTE ANT | PWR | NET | CHG | ESP-WROOM-32 | TXD | CFG | RXD | SIM7000 | DTR | PWRKEY | RTS | RUN | BOOLEAN LABS | RST | 5V | MICROSIM | GND | DEBUG/USB | +3V3 | GND | DIN | +3V3 | PIR | GND | +3V3 | SDA | SCL | GND | +3V3 | SDA | SCL | GND | GND | V+